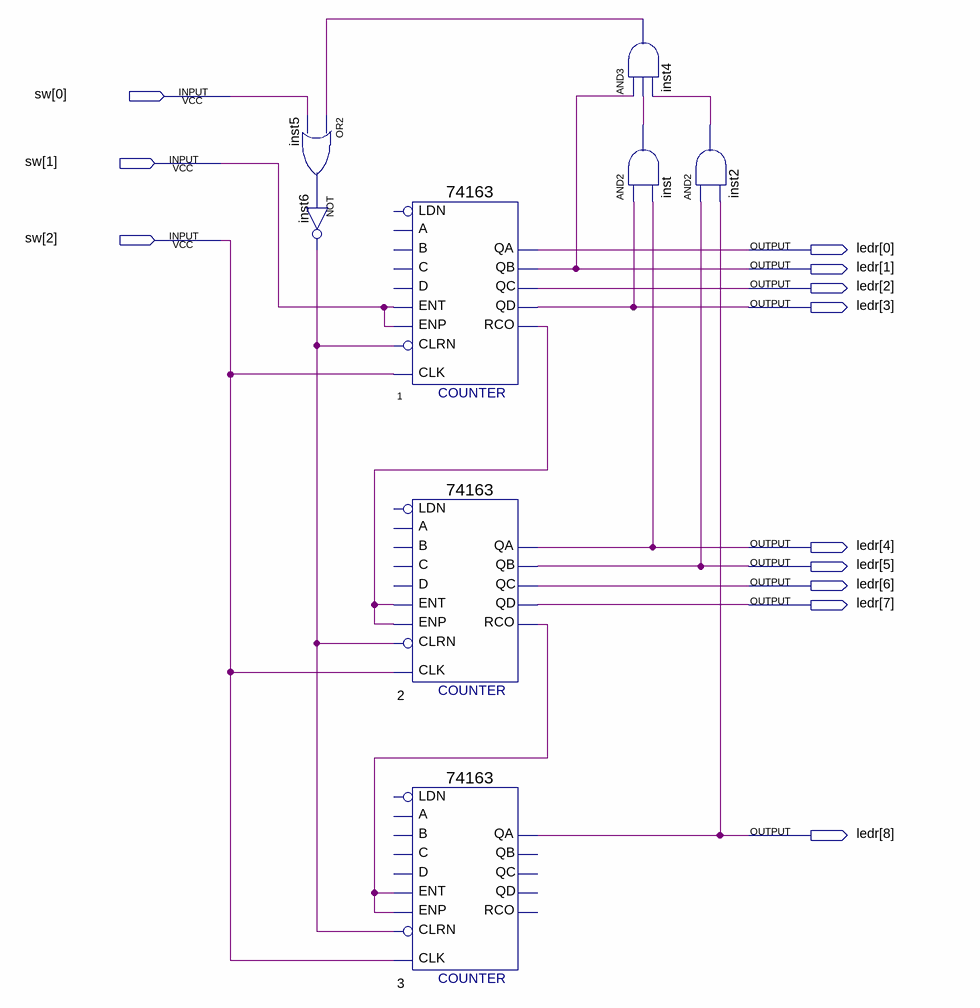
[diagram p0: schematic sheet]
// Quartus schematic mod315_sync.bdf as structural Verilog: 8 symbols, 12 pins
module mod315_sync (
  input  [2:0] sw,
  output [8:0] ledr
);

  wire inst2_out, inst4_out, inst5_out, inst6_out, inst_out, n1_rco, n2_rco;

  or inst5 (inst5_out, inst4_out, sw[0]);
  not inst6 (inst6_out, inst5_out);
  \74163  u_1 (
    .ENT(sw[1]), .CLRN(inst6_out), .CLK(sw[2]), .ENP(sw[1]), .QA(ledr[0]), .QB(ledr[1]), .QC(ledr[2]),
    .QD(ledr[3]), .RCO(n1_rco));  // open: C, B, A, D, LDN
  \74163  u_2 (
    .ENT(n1_rco), .CLRN(inst6_out), .CLK(sw[2]), .ENP(n1_rco), .QA(ledr[4]), .QB(ledr[5]), .QC(ledr[6]),
    .QD(ledr[7]), .RCO(n2_rco));  // open: C, B, A, D, LDN
  \74163  u_3 (
    .ENT(n2_rco), .CLRN(inst6_out), .CLK(sw[2]), .ENP(n2_rco), .QA(ledr[8]));  // open: C, B, A, D, LDN, QB, QC, QD, RCO
  and inst4 (inst4_out, ledr[1], inst_out, inst2_out);
  and inst (inst_out, ledr[3], ledr[4]);
  and inst2 (inst2_out, ledr[5], ledr[8]);
endmodule
